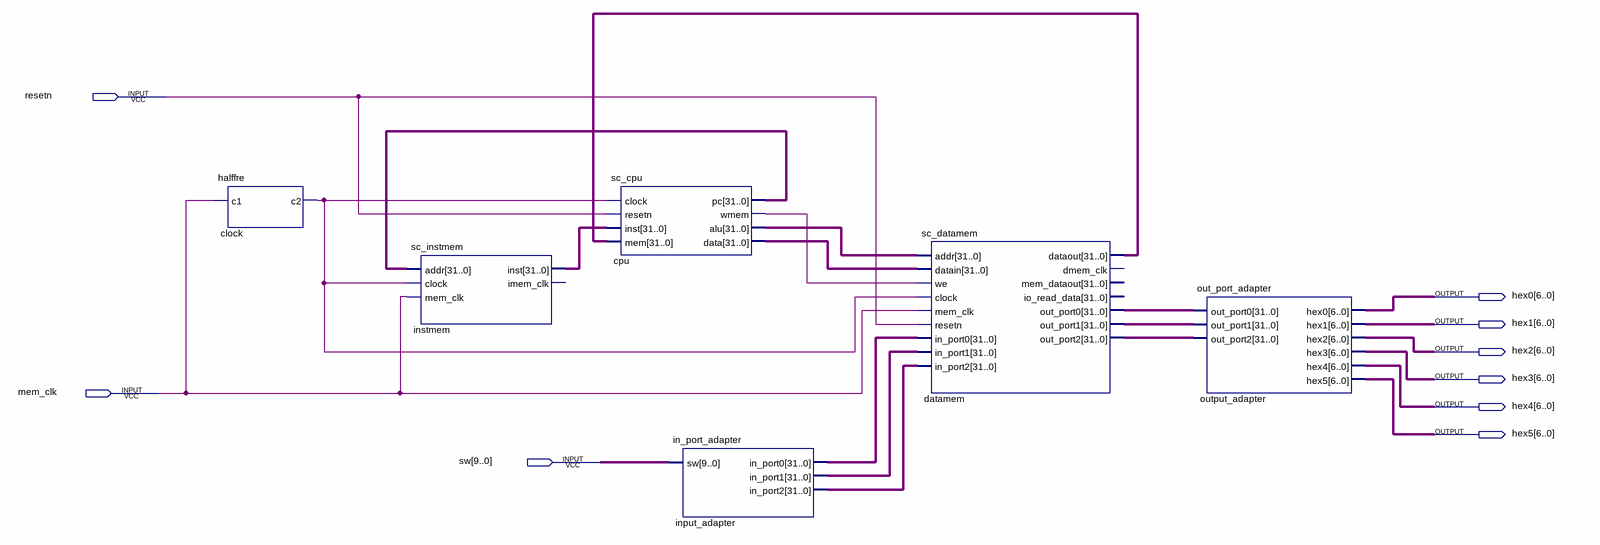
[diagram p0: schematic sheet]
// Quartus schematic sc_computer.bdf as structural Verilog: 6 symbols, 9 pins
module sc_computer (
  input  resetn,
  input  mem_clk,
  input  [9:0] sw,
  output [6:0] hex0,
  output [6:0] hex1,
  output [6:0] hex2,
  output [6:0] hex3,
  output [6:0] hex4,
  output [6:0] hex5
);

  wire clock_c2, cpu_wmem;
  wire [31:0] cpu_alu, cpu_data, cpu_pc, datamem_dataout, datamem_out_port0, datamem_out_port1,
       datamem_out_port2, input_adapter_in_port0, input_adapter_in_port1, input_adapter_in_port2,
       instmem_inst;

  halffre clock (.c1(mem_clk), .c2(clock_c2));
  sc_instmem instmem (.addr(cpu_pc), .clock(clock_c2), .mem_clk(mem_clk), .inst(instmem_inst));  // open: imem_clk
  sc_cpu cpu (
    .clock(clock_c2), .resetn(resetn), .inst(instmem_inst), .mem(datamem_dataout), .pc(cpu_pc),
    .wmem(cpu_wmem), .alu(cpu_alu), .data(cpu_data));
  in_port_adapter input_adapter (
    .sw(sw), .in_port0(input_adapter_in_port0), .in_port1(input_adapter_in_port1),
    .in_port2(input_adapter_in_port2));
  sc_datamem datamem (
    .addr(cpu_alu), .datain(cpu_data), .we(cpu_wmem), .clock(clock_c2), .mem_clk(mem_clk), .resetn(resetn),
    .in_port0(input_adapter_in_port0), .in_port1(input_adapter_in_port1), .in_port2(input_adapter_in_port2),
    .dataout(datamem_dataout), .out_port0(datamem_out_port0), .out_port1(datamem_out_port1),
    .out_port2(datamem_out_port2));  // open: dmem_clk, mem_dataout, io_read_data
  out_port_adapter output_adapter (
    .out_port0(datamem_out_port0), .out_port1(datamem_out_port1), .out_port2(datamem_out_port2), .hex0(hex0),
    .hex1(hex1), .hex2(hex2), .hex3(hex3), .hex4(hex4), .hex5(hex5));
endmodule
